# Altium schematic sheet USB.SchDoc
size A3; SheetNumber: 10; SheetTotal: 11
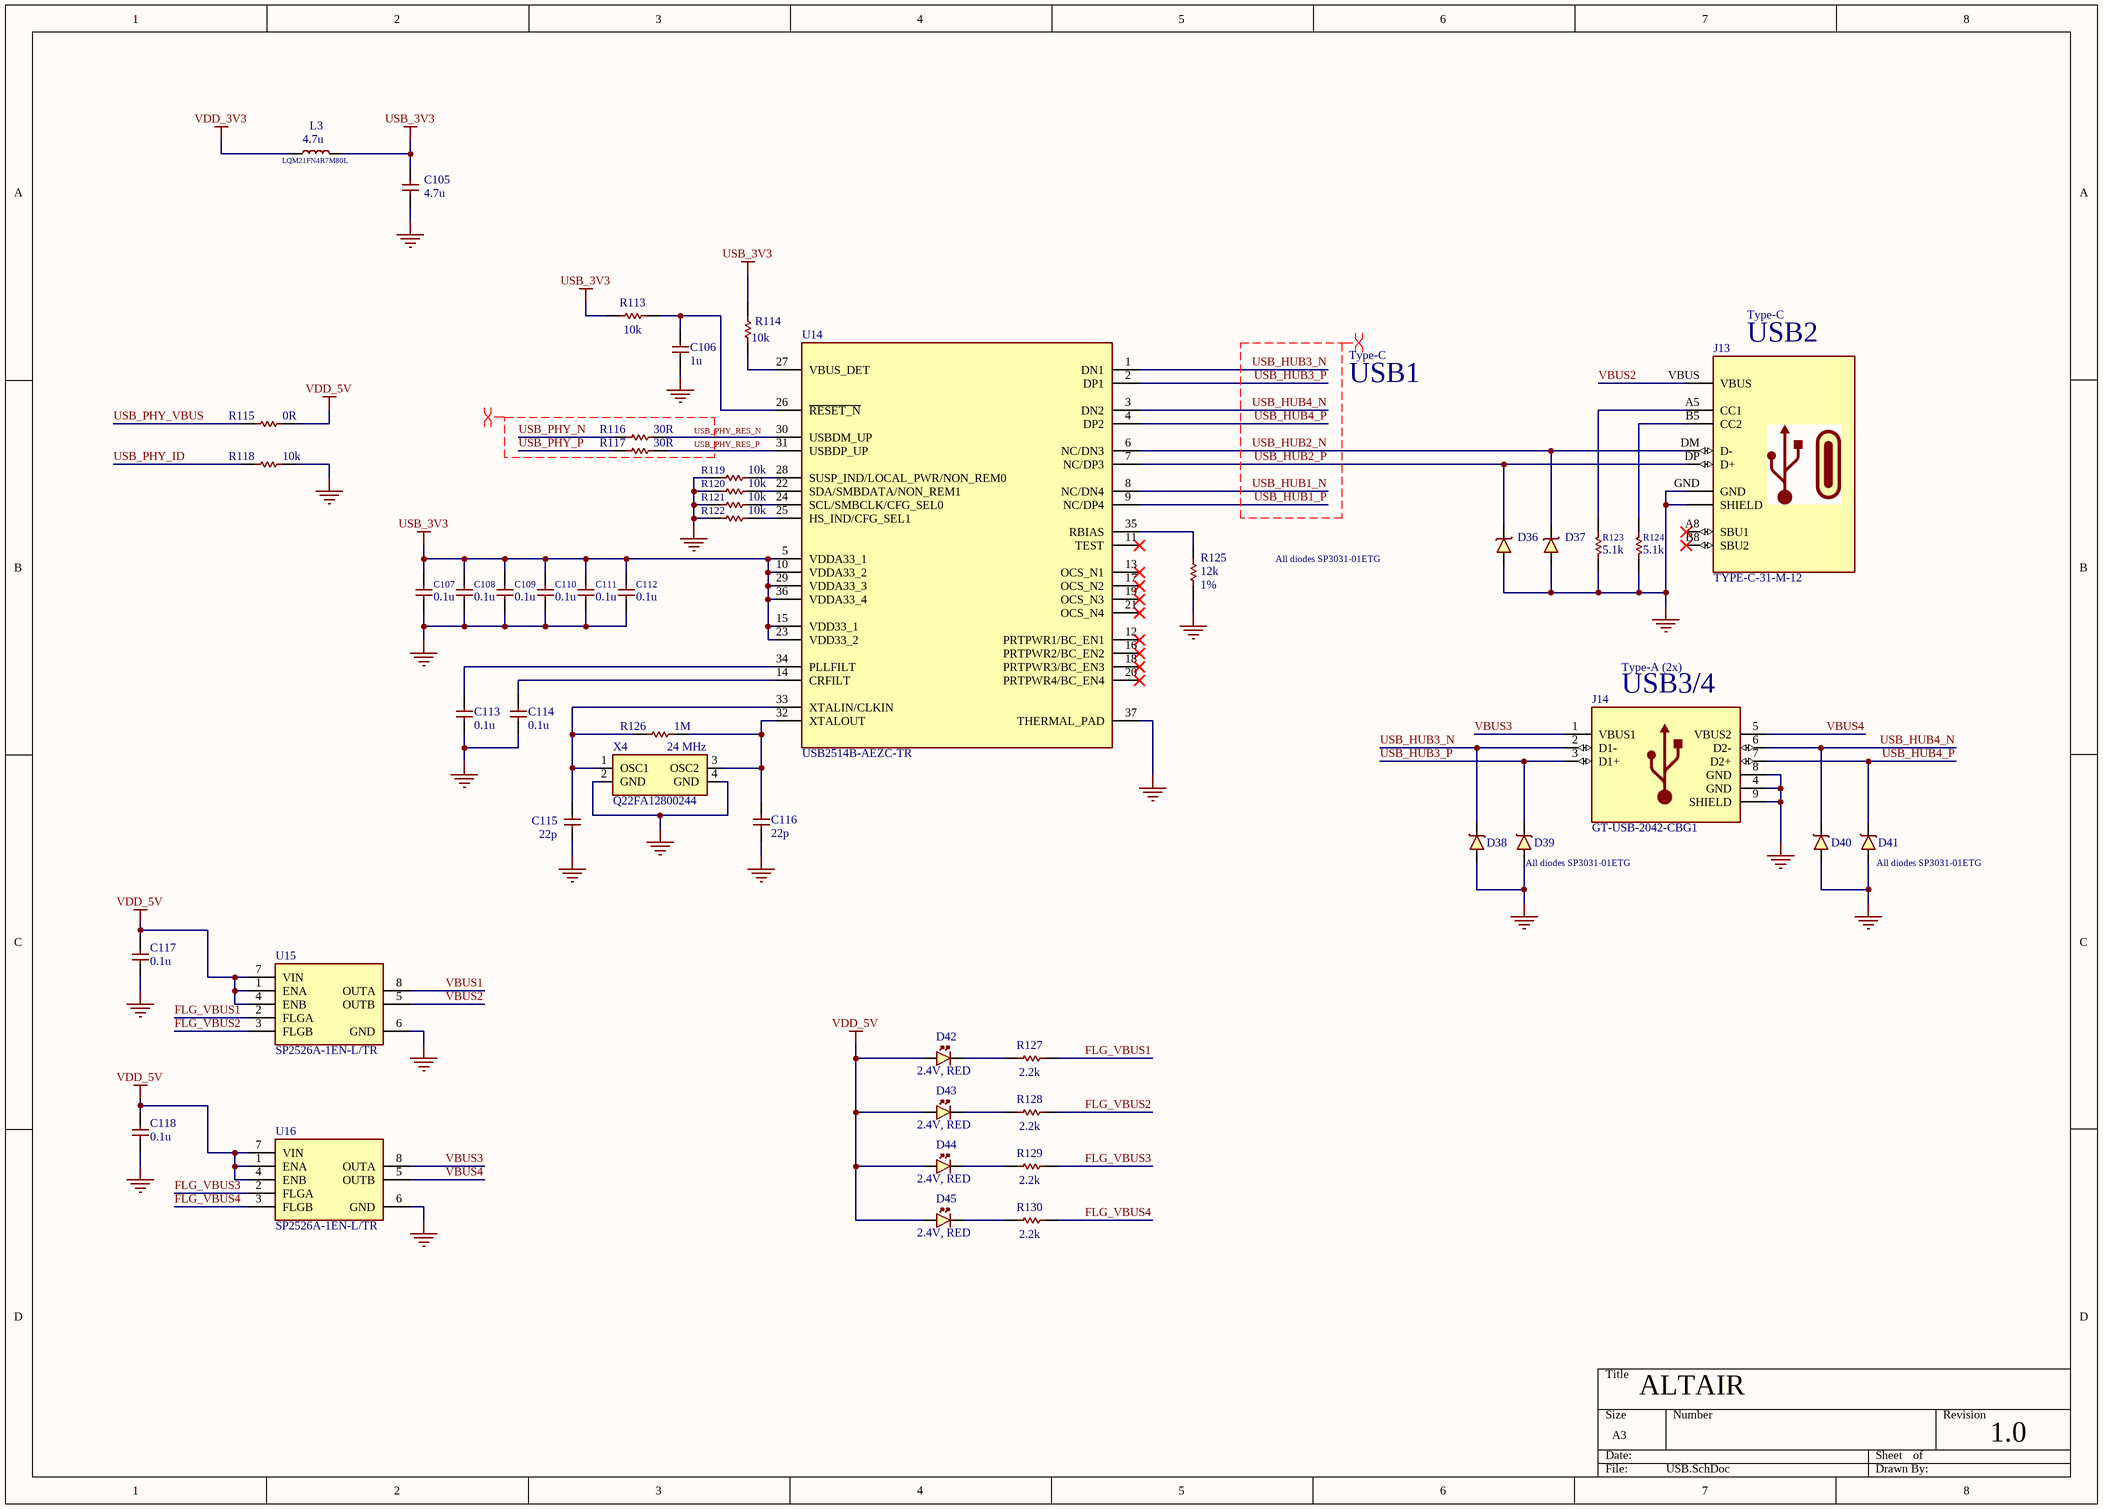
[diagram p0: USB.SchDoc]

## Parts
C105  4.7u  [CAP_0402]
C106  1u  [CAP_0402]
C107  0.1u  [CAP_0402]
C108  0.1u  [CAP_0402]
C109  0.1u  [CAP_0402]
C110  0.1u  [CAP_0402]
C111  0.1u  [CAP_0402]
C112  0.1u  [CAP_0402]
C113  0.1u  [CAP_0402]
C114  0.1u  [CAP_0402]
C115  22p  [CAP_0402]
C116  22p  [CAP_0402]
C117  0.1u  [CAP_0402]
C118  0.1u  [CAP_0402]
D36  SP3031-01ETG  [SP303101ETG]  (value not drawn)
D37  SP3031-01ETG  [SP303101ETG]  (value not drawn)
D38  SP3031-01ETG  [SP303101ETG]  (value not drawn)
D39  SP3031-01ETG  [SP303101ETG]  (value not drawn)
D40  SP3031-01ETG  [SP303101ETG]  (value not drawn)
D41  SP3031-01ETG  [SP303101ETG]  (value not drawn)
D42  Note/Misc: 2.4V, RED  [LED_0805_RED]  (hidden comment: RED)
D43  Note/Misc: 2.4V, RED  [LED_0805_RED]  (hidden comment: RED)
D44  Note/Misc: 2.4V, RED  [LED_0805_RED]  (hidden comment: RED)
D45  Note/Misc: 2.4V, RED  [LED_0805_RED]  (hidden comment: RED)
J13  TYPE-C-31-M-12  [HRO_TYPE-C-31-M-12]
J14  GT-USB-2042-CBG1  [GT-USB-2042-CBG1]
L3  4.7u  Note/Misc: LQM21FN4R7M80L  [INDC2012X145N]
R113  10k  [RES_0402]
R114  10k  [RES_0402]
R115  0R  [RES_0402]
R116  30R  [RES_0402]
R117  30R  [RES_0402]
R118  10k  [RES_0402]
R119  10k  [RES_0402]
R120  10k  [RES_0402]
R121  10k  [RES_0402]
R122  10k  [RES_0402]
R123  5.1k  [RES_0402]
R124  5.1k  [RES_0402]
R125  12k  Note/Misc: 1%  [RES_0402]
R126  1M  [RES_0402]
R127  2.2k  [RES_0402]
R128  2.2k  [RES_0402]
R129  2.2k  [RES_0402]
R130  2.2k  [RES_0402]
U14  USB2514B-AEZC-TR  [QFN50P600X600X100-37N-D]
U15  SP2526A-1EN-L/TR  [SOIC127P600X175-8N]
U16  SP2526A-1EN-L/TR  [SOIC127P600X175-8N]
X4  Note/Misc: 24 MHz  [Q22FA12800244]  (hidden comment: Q22FA12800244)

## Nets
GND: C105.1 C106.1 C107.1 C108.1 C109.1 C110.1 C111.1 C112.1 C113.1 C114.1 C115.1 C116.1 C117.1 C118.1 D36.2(A) D37.2(A) D38.2(A) D39.2(A) D40.2(A) D41.2(A) J13.GND J13.SHLD(SHIELD) J14.4(GND) J14.8(GND) J14.9(SHIELD) R118.2 R119.1 R120.1 R121.1 R122.1 R123.2 R124.2 R125.1 U14.37(THERMAL_PAD) U15.6(GND) U16.6(GND) X4.2(GND) X4.4(GND)
USB_3V3: C105.2 C107.2 C108.2 C109.2 C110.2 C111.2 C112.2 L3.2 R113.1 R114.1 U14.5(VDDA33_1) U14.10(VDDA33_2) U14.15(VDD33_1) U14.23(VDD33_2) U14.29(VDDA33_3) U14.36(VDDA33_4)
VDD_3V3: L3.1
VDD_5V: C117.2 C118.2 D42.A D43.A D44.A D45.A R115.2 U15.1(ENA) U15.4(ENB) U15.7(VIN) U16.1(ENA) U16.4(ENB) U16.7(VIN)
FLG_VBUS1: R127.2 U15.2(FLGA)
FLG_VBUS2: R128.2 U15.3(FLGB)
FLG_VBUS3: R129.2 U16.2(FLGA)
FLG_VBUS4: R130.2 U16.3(FLGB)
USB_HUB1_N: U14.8(NC/DN4)
USB_HUB1_P: U14.9(NC/DP4)
USB_HUB2_N: D37.1(K) J13.DM(D-) U14.6(NC/DN3)
USB_HUB2_P: D36.1(K) J13.DP(D+) U14.7(NC/DP3)
USB_HUB3_N: D38.1(K) J14.2(D1-) U14.1(DN1)
USB_HUB3_P: D39.1(K) J14.3(D1+) U14.2(DP1)
USB_HUB4_N: D40.1(K) J14.6(D2-) U14.3(DN2)
USB_HUB4_P: D41.1(K) J14.7(D2+) U14.4(DP2)
USB_PHY_ID: R118.1
USB_PHY_N: R116.1
USB_PHY_P: R117.1
USB_PHY_RES_N: R116.2 U14.30(USBDM_UP)
USB_PHY_RES_P: R117.2 U14.31(USBDP_UP)
USB_PHY_VBUS: R115.1
VBUS1: U15.8(OUTA)
VBUS2: J13.VBUS U15.5(OUTB)
VBUS3: J14.1(VBUS1) U16.8(OUTA)
VBUS4: J14.5(VBUS2) U16.5(OUTB)
NetC106_2: C106.2 R113.2 U14.26(~{RESET_N})
NetC113_2: C113.2 U14.34(PLLFILT)
NetC114_2: C114.2 U14.14(CRFILT)
NetC115_2: C115.2 R126.2 U14.33(XTALIN/CLKIN) X4.1(OSC1)
NetC116_2: C116.2 R126.1 U14.32(XTALOUT) X4.3(OSC2)
NetD42_K: D42.K R127.1
NetD43_K: D43.K R128.1
NetD44_K: D44.K R129.1
NetD45_K: D45.K R130.1
NetJ13_A5: J13.A5(CC1) R123.1
NetJ13_B5: J13.B5(CC2) R124.1
NetR114_2: R114.2 U14.27(VBUS_DET)
NetR119_2: R119.2 U14.28(SUSP_IND/LOCAL_PWR/NON_REM0)
NetR120_2: R120.2 U14.22(SDA/SMBDATA/NON_REM1)
NetR121_2: R121.2 U14.24(SCL/SMBCLK/CFG_SEL0)
NetR122_2: R122.2 U14.25(HS_IND/CFG_SEL1)
NetR125_2: R125.2 U14.35(RBIAS)

Not connected (* = marked no-connect by the designer): J13 A8(SBU1)* B8(SBU2)*; U14 11(TEST)* 12(PRTPWR1/BC_EN1)* 13(OCS_N1)* 16(PRTPWR2/BC_EN2)* 17(OCS_N2)* 18(PRTPWR3/BC_EN3)* 19(OCS_N3)* 20(PRTPWR4/BC_EN4)* 21(OCS_N4)*

## Layout directives
differential pair: USB_HUB1_N, USB_HUB1_P, USB_HUB2_N, USB_HUB2_P, USB_HUB3_N, USB_HUB3_P, USB_HUB4_N, USB_HUB4_P, USB_PHY_N, USB_PHY_P, USB_PHY_RES_N, USB_PHY_RES_P

## Notes on the sheet
- Type-C
- (near J13) USB2
- USB1
- (near D36) All diodes SP3031-01ETG
- (near J14) USB3/4
- Type-A (2x)
- (near D39) All diodes SP3031-01ETG
- (near D41) All diodes SP3031-01ETG
- ALTAIR
- 1.0

## Library data of the parts
C105 = CAP_0402: Capacitor SMD 0402; Part No: HGC0402R5475M250NTEJ; LCSC: *; JLCPCB Part #: C22367824; Footprint JLCPCB: 0402
C106 = CAP_0402: Capacitor SMD 0402; Part No: CL05A105KP5NNNC; Note/Misc: 10V; LCSC: *; JLCPCB Part #: C14445; Footprint JLCPCB: 0402
C107-C114 C117 C118 = CAP_0402: Capacitor SMD 0402; Part No: CL05B104KO5NNNC; Note/Misc: 16V, 0402; LCSC: *; JLCPCB Part #: C338112; Footprint JLCPCB: 0402
C115 C116 = CAP_0402: Capacitor SMD 0402; Part No: CC0402JRNPO8BN220; LCSC: *; JLCPCB Part #: C541361; Footprint JLCPCB: 0402
D36-D41 = SP3031-01ETG: TVS Diode (Uni-directional); Footprint JLCPCB: SOD-882; JLCPCB Part #: C207283; LCSC: *; Note/Misc: *; Part No: SP3031-01ETG
D42-D45 = LED_0805_RED: LED 0805 RED SMD; Part No: HL-PSC-2012S9AC; LCSC: *; Footprint JLCPCB: 0805; JLCPCB Part #: C497952
J13 = TYPE-C-31-M-12: USB2.0, Type C, Top mount, CH 1.68mm, Dual Row SMT; LCSC: *; Note/Misc: *; Part No: TYPE-C-31-M-12; JLCPCB Part #: C165948; Footprint JLCPCB: SMD
J14 = GT-USB-2042-CBG1: 2x USB Type-A Female Connector; LCSC: *; Note/Misc: *; Part No: GT-USB-2042-CBG1; JLCPCB Part #: C2911522; Footprint JLCPCB: Plugin
L3 = LQM21FN4R7M70L: Inductor; LCSC: *; Part No: LQM21FN4R7M80L; JLCPCB Part #: C464406; Footprint JLCPCB: 0805
R113 R114 R118-R122 = RES_0402: Resistor SMD 0402; Part No: RC0402JR-0710KL; LCSC: *; JLCPCB Part #: C60489; Footprint JLCPCB: 0402
R115 = RES_0402: Resistor SMD 0402; Part No: RC0402JR-070RL; LCSC: *; JLCPCB Part #: C60485; Footprint JLCPCB: 0402
R116 R117 = RES_0402: Resistor SMD 0402; Part No: RC0402FR-0730RL; Note/Misc: 1%; LCSC: *; JLCPCB Part #: C138007; Footprint JLCPCB: 0402
R123 R124 = RES_0402: Resistor SMD 0402; Part No: RC0402JR-075K1L; LCSC: *; JLCPCB Part #: C105873; Footprint JLCPCB: 0402
R125 = RES_0402: Resistor SMD 0402; Part No: RC0402FR-0712KL; LCSC: *; JLCPCB Part #: C114760; Footprint JLCPCB: 0402
R126 = RES_0402: Resistor SMD 0402; Part No: RC0402JR-071ML; LCSC: *; JLCPCB Part #: C93949; Footprint JLCPCB: 0402
R127-R130 = RES_0402: Resistor SMD 0402; Part No: RC0402JR-072K2L; LCSC: *; JLCPCB Part #: C163447; Footprint JLCPCB: 0402
U14 = USB2514B-AEZC-TR: USB Hub; LCSC: *; Note/Misc: *; Part No: USB2514B-AEZC-TR; JLCPCB Part #: C16251; Footprint JLCPCB: VQFN-36-EP(6x6)
X4 = Q22FA12800244: 24 MHz Crystal SMD 4-Pin 2.0x1.6mm 4 Pins Alt; JLCPCB Part #: C255880; LCSC: *; Footprint JLCPCB: SMD2016-4P; Part No: Q22FA12800244
U15 U16 = SP2526A-1EN-L/TR: LCSC: *; Note/Misc: *; Part No: SP2526A-1EN-L/TR; JLCPCB Part #: C37347; Footprint JLCPCB: SOIC-8